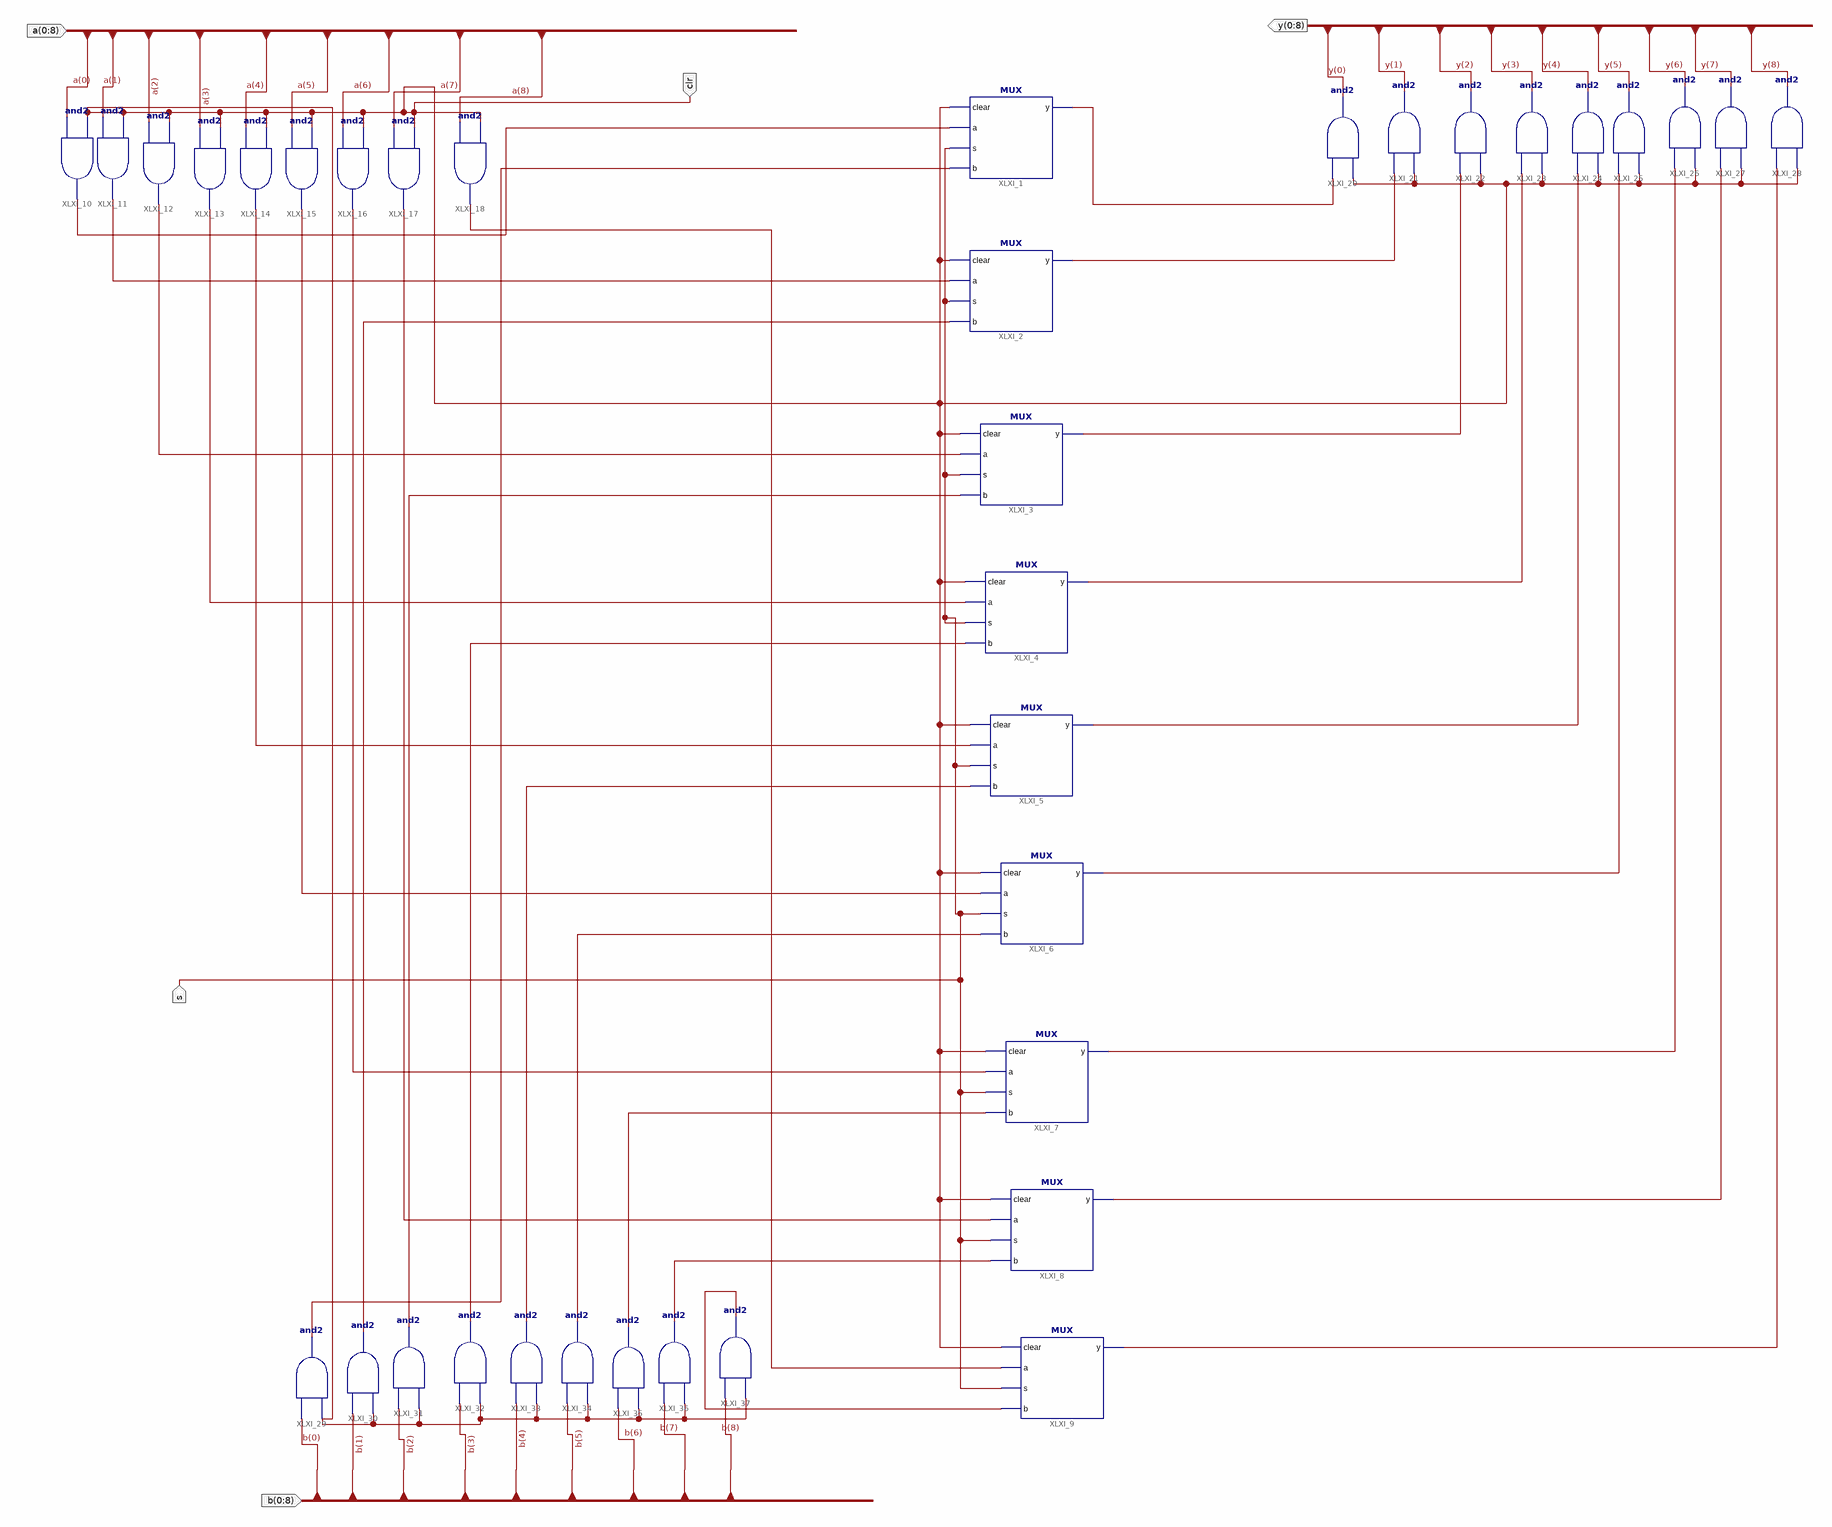
[diagram p0: schematic sheet 1]
// Xilinx ISE schematic ninebit2_1mux.sch (artix7) as structural Verilog: 36 symbols, 5 ports
module ninebit2_1mux (
  input  [0:8] a,
  input  [0:8] b,
  input  s,
  input  clr,
  output [0:8] y
);

  wire XLXN_189, XLXN_190, XLXN_191, XLXN_192, XLXN_193, XLXN_194, XLXN_195, XLXN_196, XLXN_197, XLXN_207,
       XLXN_208, XLXN_209, XLXN_210, XLXN_211, XLXN_212, XLXN_213, XLXN_214, XLXN_215, XLXN_226, XLXN_228,
       XLXN_230, XLXN_231, XLXN_232, XLXN_233, XLXN_234, XLXN_235, XLXN_236;

  MUX XLXI_1 (.clear(clr), .a(XLXN_189), .s(s), .b(XLXN_207), .y(XLXN_226));
  MUX XLXI_2 (.clear(clr), .a(XLXN_190), .s(s), .b(XLXN_208), .y(XLXN_228));
  MUX XLXI_3 (.clear(clr), .a(XLXN_191), .s(s), .b(XLXN_209), .y(XLXN_230));
  MUX XLXI_4 (.clear(clr), .a(XLXN_192), .s(s), .b(XLXN_210), .y(XLXN_231));
  MUX XLXI_5 (.clear(clr), .a(XLXN_193), .s(s), .b(XLXN_211), .y(XLXN_232));
  MUX XLXI_6 (.clear(clr), .a(XLXN_194), .s(s), .b(XLXN_212), .y(XLXN_233));
  MUX XLXI_7 (.clear(clr), .a(XLXN_195), .s(s), .b(XLXN_213), .y(XLXN_234));
  MUX XLXI_8 (.clear(clr), .a(XLXN_196), .s(s), .b(XLXN_214), .y(XLXN_235));
  MUX XLXI_9 (.clear(clr), .a(XLXN_197), .s(s), .b(XLXN_215), .y(XLXN_236));
  and XLXI_10 (XLXN_189, a[0], clr);
  and XLXI_11 (XLXN_190, a[1], clr);
  and XLXI_12 (XLXN_191, a[2], clr);
  and XLXI_13 (XLXN_192, a[3], clr);
  and XLXI_14 (XLXN_193, a[4], clr);
  and XLXI_15 (XLXN_194, a[5], clr);
  and XLXI_16 (XLXN_195, a[6], clr);
  and XLXI_17 (XLXN_196, a[7], clr);
  and XLXI_18 (XLXN_197, a[8], clr);
  and XLXI_20 (y[0], clr, XLXN_226);
  and XLXI_21 (y[1], clr, XLXN_228);
  and XLXI_22 (y[2], clr, XLXN_230);
  and XLXI_23 (y[3], clr, XLXN_231);
  and XLXI_24 (y[4], clr, XLXN_232);
  and XLXI_25 (y[5], clr, XLXN_233);
  and XLXI_26 (y[6], clr, XLXN_234);
  and XLXI_27 (y[7], clr, XLXN_235);
  and XLXI_28 (y[8], clr, XLXN_236);
  and XLXI_29 (XLXN_207, clr, b[0]);
  and XLXI_30 (XLXN_208, clr, b[1]);
  and XLXI_31 (XLXN_209, clr, b[2]);
  and XLXI_32 (XLXN_210, clr, b[3]);
  and XLXI_33 (XLXN_211, clr, b[4]);
  and XLXI_34 (XLXN_212, clr, b[5]);
  and XLXI_35 (XLXN_213, clr, b[6]);
  and XLXI_36 (XLXN_214, clr, b[7]);
  and XLXI_37 (XLXN_215, clr, b[8]);
endmodule
